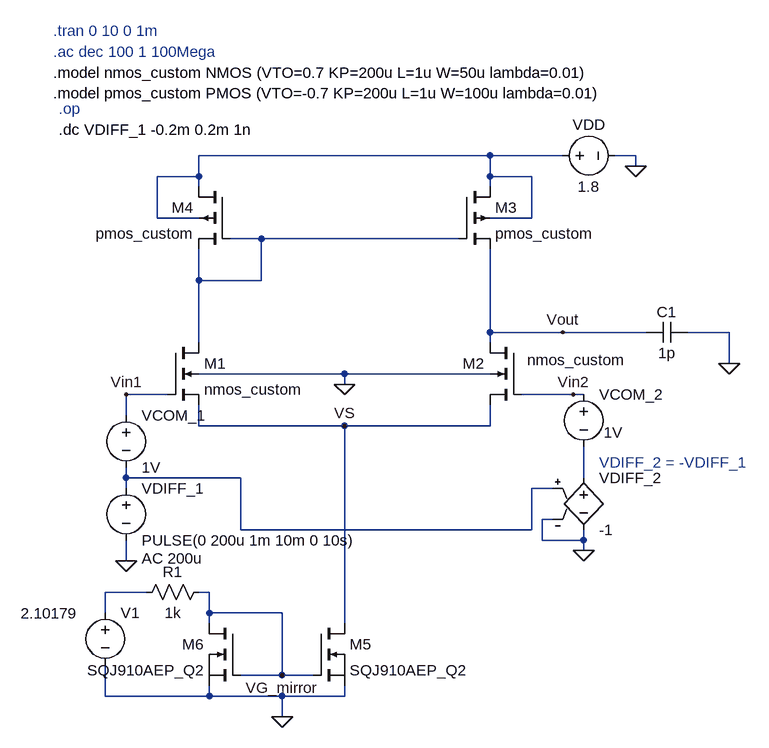
[diagram p0: schematic diffamp_res.asc]
diffamp_res.asc, the LTspice schematic file:
Version 4.1
SHEET 1 1020 708
WIRE 608 -176 160 -176
WIRE 720 -176 608 -176
WIRE 832 -176 800 -176
WIRE 832 -160 832 -176
WIRE 160 -144 160 -176
WIRE 160 -144 96 -144
WIRE 608 -144 608 -176
WIRE 672 -144 608 -144
WIRE 160 -128 160 -144
WIRE 608 -128 608 -144
WIRE 96 -80 96 -144
WIRE 160 -80 96 -80
WIRE 672 -80 672 -144
WIRE 672 -80 608 -80
WIRE 256 -48 208 -48
WIRE 560 -48 256 -48
WIRE 160 16 160 -32
WIRE 256 16 256 -48
WIRE 256 16 160 16
WIRE 608 96 608 -32
WIRE 720 96 608 96
WIRE 848 96 720 96
WIRE 976 96 912 96
WIRE 160 112 160 16
WIRE 608 112 608 96
WIRE 976 144 976 96
WIRE 384 160 160 160
WIRE 608 160 384 160
WIRE 384 176 384 160
WIRE 112 192 48 192
WIRE 736 192 656 192
WIRE 752 192 736 192
WIRE 48 224 48 192
WIRE 160 240 160 208
WIRE 384 240 160 240
WIRE 608 240 608 208
WIRE 608 240 384 240
WIRE 48 320 48 304
WIRE 224 320 48 320
WIRE 752 320 752 272
WIRE 48 336 48 320
WIRE 704 336 672 336
WIRE 704 384 688 384
WIRE 224 400 224 320
WIRE 672 400 672 336
WIRE 672 400 224 400
WIRE 688 416 688 384
WIRE 752 416 752 400
WIRE 752 416 688 416
WIRE 752 432 752 416
WIRE 48 448 48 416
WIRE 80 496 16 496
WIRE 176 496 160 496
WIRE 16 528 16 496
WIRE 176 528 176 496
WIRE 288 528 176 528
WIRE 176 544 176 528
WIRE 384 544 384 240
WIRE 288 624 288 528
WIRE 288 624 224 624
WIRE 336 624 288 624
WIRE 16 656 16 608
WIRE 176 656 176 640
WIRE 176 656 16 656
WIRE 288 656 176 656
WIRE 384 656 384 640
WIRE 384 656 288 656
WIRE 288 688 288 656
FLAG 720 96 Vout
FLAG 384 240 VS
FLAG 832 -160 0
FLAG 752 432 0
FLAG 48 448 0
FLAG 48 192 Vin1
FLAG 736 192 Vin2
FLAG 384 176 0
FLAG 288 688 0
FLAG 288 624 VG_mirror
FLAG 976 144 0
SYMBOL voltage 48 208 R0
WINDOW 123 0 0 Left 0
WINDOW 39 0 0 Left 0
SYMATTR InstName VCOM_1
SYMATTR Value 1V
SYMBOL voltage 704 -176 R270
WINDOW 0 32 56 VTop 2
WINDOW 3 -32 56 VBottom 2
WINDOW 123 0 0 Left 0
WINDOW 39 0 0 Left 0
SYMATTR InstName VDD
SYMATTR Value 1.8
SYMBOL e 752 304 R0
SYMATTR InstName VDIFF_2
SYMATTR Value -1
SYMBOL voltage 752 176 R0
WINDOW 3 31 74 Left 2
WINDOW 123 0 0 Left 0
WINDOW 39 0 0 Left 0
SYMATTR Value 1V
SYMATTR InstName VCOM_2
SYMBOL voltage 48 320 R0
WINDOW 123 24 124 Left 2
WINDOW 39 0 0 Left 0
SYMATTR Value2 AC 200u
SYMATTR InstName VDIFF_1
SYMATTR Value PULSE(0 200u 1m 10m 0 10s)
SYMBOL nmos4 112 112 R0
SYMATTR InstName M1
SYMATTR Value nmos_custom
SYMBOL nmos4 656 112 M0
WINDOW 3 -160 27 Left 2
SYMATTR Value nmos_custom
SYMATTR InstName M2
SYMBOL pmos4 560 -128 R0
SYMATTR InstName M3
SYMATTR Value pmos_custom
SYMBOL pmos4 208 -128 M0
SYMATTR InstName M4
SYMATTR Value pmos_custom
SYMBOL nmos 336 544 R0
SYMATTR InstName M5
SYMATTR Value SQJ910AEP_Q2
SYMBOL nmos 224 544 M0
SYMATTR InstName M6
SYMATTR Value SQJ910AEP_Q2
SYMBOL res 176 480 R90
WINDOW 0 0 56 VBottom 2
WINDOW 3 32 56 VTop 2
SYMATTR InstName R1
SYMATTR Value 1k
SYMBOL voltage 16 512 R0
WINDOW 3 -130 17 Left 2
WINDOW 123 0 0 Left 0
WINDOW 39 0 0 Left 0
SYMATTR Value 2.10179
SYMATTR InstName V1
SYMBOL cap 912 80 R90
WINDOW 0 0 32 VBottom 2
WINDOW 3 32 32 VTop 2
SYMATTR InstName C1
SYMATTR Value 1p
TEXT -56 -248 Left 2 ;.op
TEXT 776 296 Left 2 ;VDIFF_2 = -VDIFF_1
TEXT -56 -216 Left 2 !.dc VDIFF_1 -0.2m 0.2m 1n
TEXT -64 -304 Left 2 !.model nmos_custom NMOS (VTO=0.7 KP=200u L=1u W=50u lambda=0.01)
TEXT -64 -272 Left 2 !.model pmos_custom PMOS (VTO=-0.7 KP=200u L=1u W=100u lambda=0.01)
TEXT -64 -336 Left 2 ;.ac dec 100 1 100Mega
TEXT -64 -368 Left 2 ;.tran 0 10 0 1m

The netlist it stands for:
* diffamp_res.asc
VCOM_1 Vin1 N003 1V
VDD N001 0 1.8
E§VDIFF_2 N004 0 N003 0 -1
VCOM_2 Vin2 N004 1V
VDIFF_1 N003 0 PULSE(0 200u 1m 10m 0 10s) AC 200u
M1 N002 Vin1 VS 0 nmos_custom
M2 Vout Vin2 VS 0 nmos_custom
M3 N001 N002 Vout N001 pmos_custom
M4 N001 N002 N002 N001 pmos_custom
M5 VS VG_mirror 0 0 SQJ910AEP_Q2
M6 VG_mirror VG_mirror 0 0 SQJ910AEP_Q2
R1 VG_mirror N005 1k
V1 N005 0 2.10179
C1 0 Vout 1p
.model NMOS NMOS
.model PMOS PMOS
.lib standard.mos
* .op
* VDIFF_2 = -VDIFF_1
.dc VDIFF_1 -0.2m 0.2m 1n
.model nmos_custom NMOS (VTO=0.7 KP=200u L=1u W=50u lambda=0.01)
.model pmos_custom PMOS (VTO=-0.7 KP=200u L=1u W=100u lambda=0.01)
* .ac dec 100 1 100Mega
* .tran 0 10 0 1m
.backanno
.end